# Altium schematic sheet MIXER.SchDoc
size 431 x 279 mm
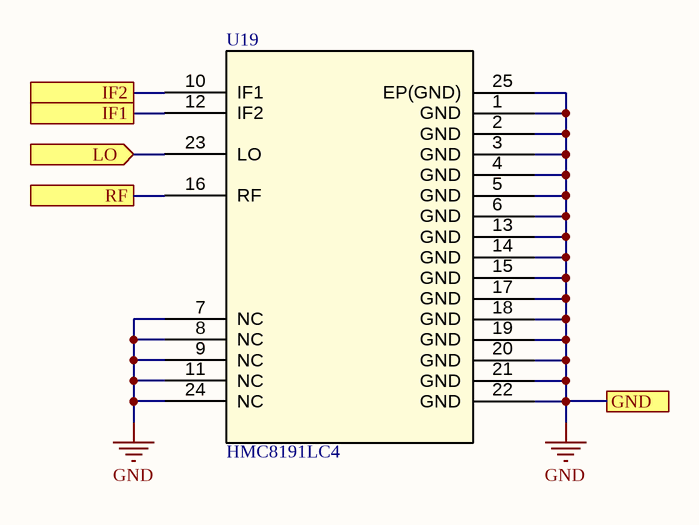
[diagram p0: MIXER.SchDoc]

## Parts
U19  HMC8191LC4  [HMC8191_E-24-1]

## Ports
GND, IF1, IF2, LO (in), RF

## Nets
GND: U19.1(GND) U19.2(GND) U19.3(GND) U19.4(GND) U19.5(GND) U19.6(GND) U19.7(NC) U19.8(NC) U19.9(NC) U19.11(NC) U19.13(GND) U19.14(GND) U19.15(GND) U19.17(GND) U19.18(GND) U19.19(GND) U19.20(GND) U19.21(GND) U19.22(GND) U19.24(NC) U19.25(EP(GND)) ; port GND
IF1: U19.12(IF2) ; port IF1
IF2: U19.10(IF1) ; port IF2
LO: U19.23(LO) ; port LO
RF: U19.16(RF) ; port RF

## Notes on the sheet
- DWG. NO.
- REV.
- SHT.
- THIS DOCUMENT AND THE DATA DISCLOSED HEREIN OR HEREWITH IS THE PROPERTY OF ALTIUM LIMITED AND MAY BE FREELY DISTRIBUTED IN WHOLE. NO RIGHTS ARE RESERVED OR EXPRESS OR IMPLIED WARANTEE GIVEN.
- REVISION
- DESCRIPTION
- DATE
- APPROVED
- ENG:
- APPROVALS
- PROJECT
- DSN:
- CHK:
- REFERENCE DOCUMENTS
- PROJECT REVISION:
- TITLE
- DOCUMENT REVISION:
- DESIGN ITEM:
- BOM:
- FAB DWG:
- PCB DWG:
- ASSY DWG:
- SCALE:
- SIZE
- B
- CAGE CODE
- FILE NAME
- DWG NO.
- SHEET
- OF
- REV

## Library data of the parts
U19 = HMC8191LC4: 6 GHz to 26.5 GHz, / Wideband I/Q Mixer; Copyright: Copyright (C) 2018 Accelerated Designs. All rights reserved; RefDes: RefDes; Type: DEV